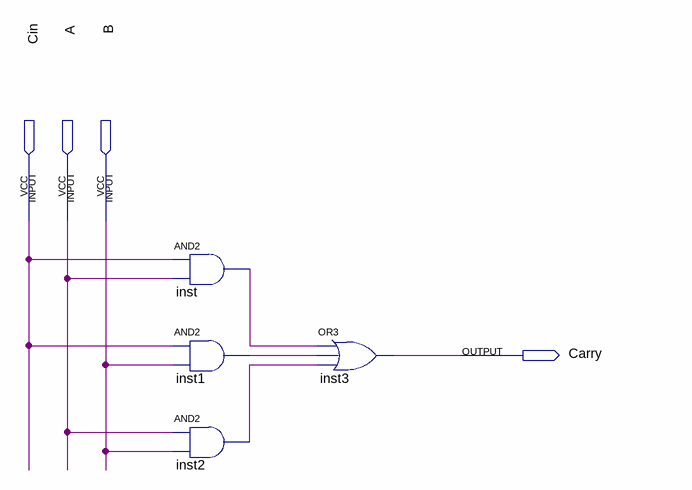
[diagram p0: schematic sheet]
// Quartus schematic Biencarry.bdf as structural Verilog: 4 symbols, 4 pins
module Biencarry (
  input  Cin,
  input  A,
  input  B,
  output Carry
);

  wire inst1_out, inst2_out, inst_out;

  and inst (inst_out, Cin, A);
  and inst1 (inst1_out, Cin, B);
  and inst2 (inst2_out, A, B);
  or inst3 (Carry, inst_out, inst1_out, inst2_out);
endmodule
